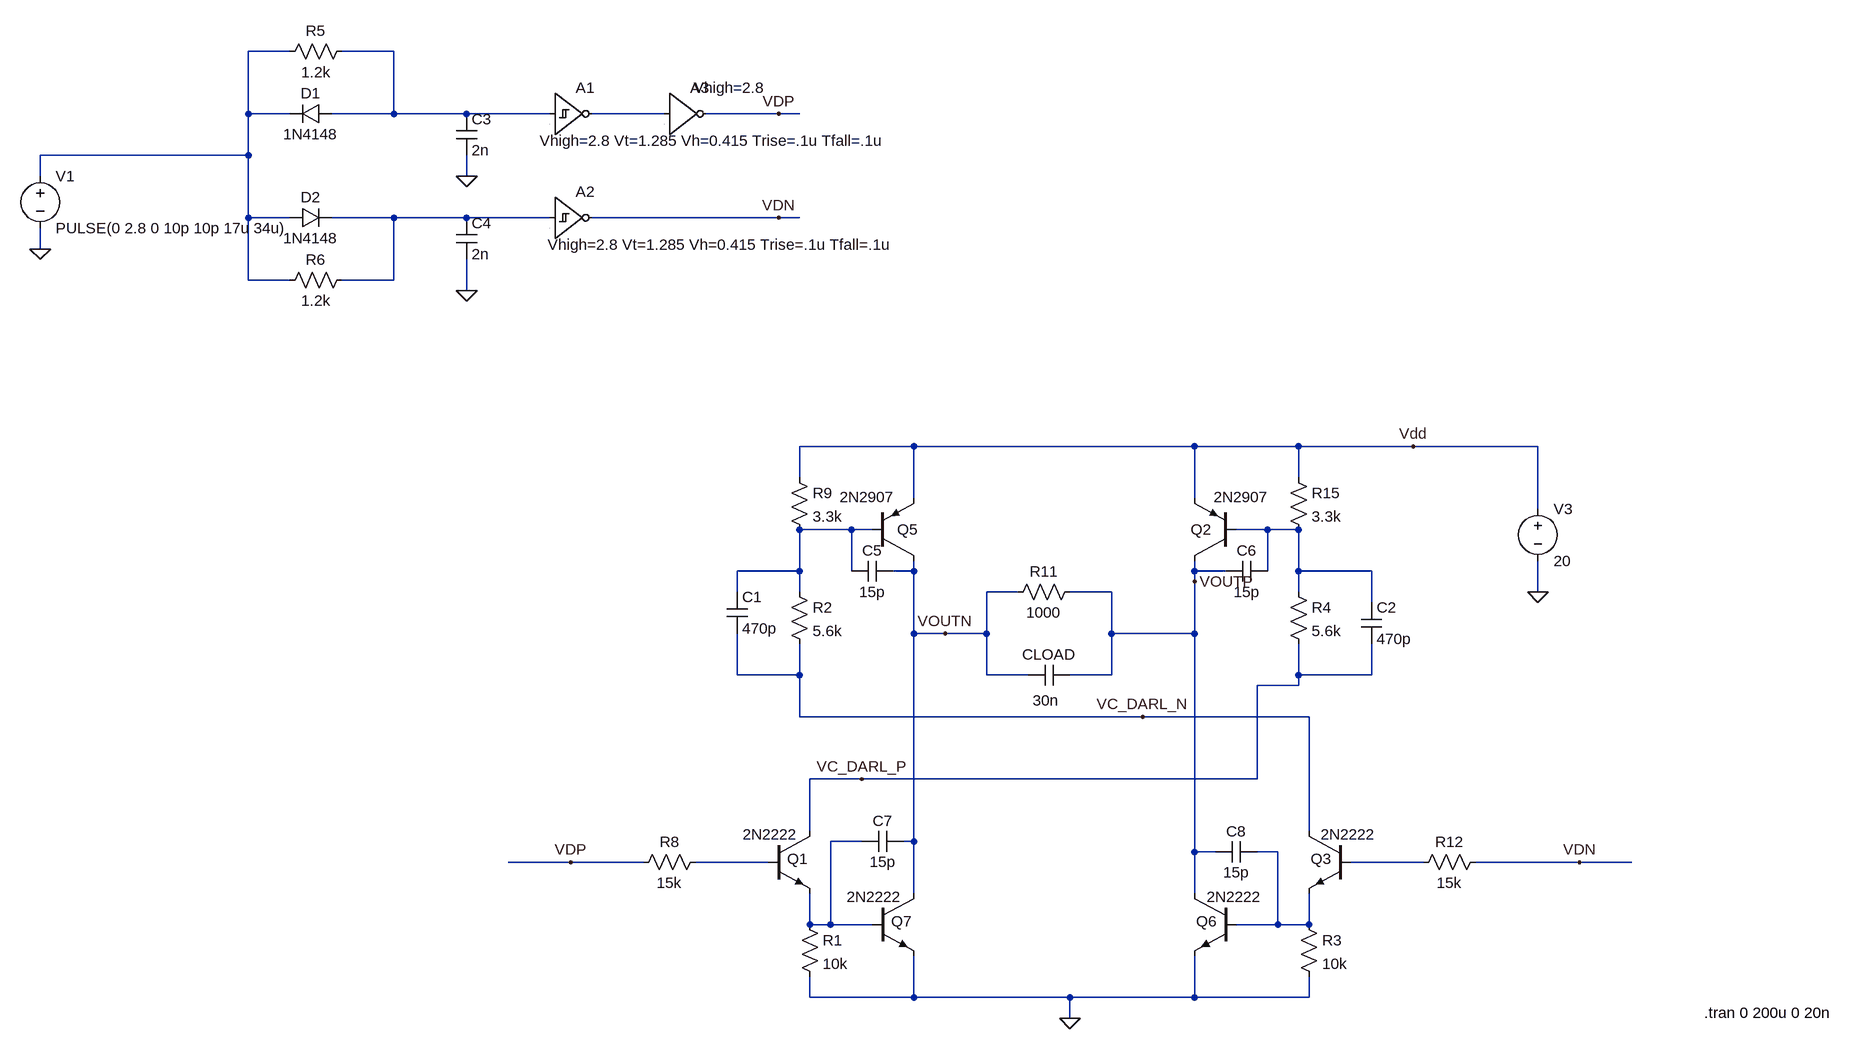
[diagram p0: schematic HbridgePiezo_opt3.asc]
HbridgePiezo_opt3.asc, the LTspice schematic file:
Version 4
SHEET 1 1368 680
WIRE -1136 -1296 -1200 -1296
WIRE -976 -1296 -1056 -1296
WIRE -1200 -1200 -1200 -1296
WIRE -1136 -1200 -1200 -1200
WIRE -976 -1200 -976 -1296
WIRE -976 -1200 -1072 -1200
WIRE -864 -1200 -976 -1200
WIRE -736 -1200 -864 -1200
WIRE -560 -1200 -672 -1200
WIRE -384 -1200 -496 -1200
WIRE -352 -1200 -384 -1200
WIRE -1200 -1136 -1200 -1200
WIRE -1200 -1136 -1520 -1136
WIRE -1520 -1104 -1520 -1136
WIRE -864 -1104 -864 -1136
WIRE -1200 -1040 -1200 -1136
WIRE -1136 -1040 -1200 -1040
WIRE -976 -1040 -1072 -1040
WIRE -864 -1040 -976 -1040
WIRE -736 -1040 -864 -1040
WIRE -384 -1040 -672 -1040
WIRE -352 -1040 -384 -1040
WIRE -1520 -992 -1520 -1024
WIRE -1200 -944 -1200 -1040
WIRE -1136 -944 -1200 -944
WIRE -976 -944 -976 -1040
WIRE -976 -944 -1056 -944
WIRE -864 -928 -864 -976
WIRE -176 -688 -352 -688
WIRE 256 -688 -176 -688
WIRE 416 -688 256 -688
WIRE 592 -688 416 -688
WIRE 784 -688 592 -688
WIRE -352 -640 -352 -688
WIRE 416 -640 416 -688
WIRE -176 -608 -176 -688
WIRE 256 -608 256 -688
WIRE 784 -592 784 -688
WIRE -272 -560 -352 -560
WIRE -240 -560 -272 -560
WIRE 368 -560 320 -560
WIRE 416 -560 368 -560
WIRE -352 -496 -352 -560
WIRE -352 -496 -448 -496
WIRE -272 -496 -272 -560
WIRE -176 -496 -176 -512
WIRE -176 -496 -208 -496
WIRE 256 -496 256 -512
WIRE 304 -496 256 -496
WIRE 368 -496 368 -560
WIRE 416 -496 416 -560
WIRE 528 -496 416 -496
WIRE 256 -480 256 -496
WIRE -448 -464 -448 -496
WIRE -352 -464 -352 -496
WIRE -16 -464 -64 -464
WIRE 128 -464 64 -464
WIRE 416 -464 416 -496
WIRE 784 -464 784 -512
WIRE 528 -448 528 -496
WIRE -176 -400 -176 -496
WIRE -128 -400 -176 -400
WIRE -64 -400 -64 -464
WIRE -64 -400 -128 -400
WIRE 128 -400 128 -464
WIRE 256 -400 256 -480
WIRE 256 -400 128 -400
WIRE -448 -336 -448 -400
WIRE -352 -336 -352 -384
WIRE -352 -336 -448 -336
WIRE -64 -336 -64 -400
WIRE 0 -336 -64 -336
WIRE 128 -336 128 -400
WIRE 128 -336 64 -336
WIRE 416 -336 416 -384
WIRE 528 -336 528 -384
WIRE 528 -336 416 -336
WIRE 416 -320 416 -336
WIRE 416 -320 352 -320
WIRE -352 -272 -352 -336
WIRE 176 -272 -352 -272
WIRE 432 -272 176 -272
WIRE -256 -176 -336 -176
WIRE 352 -176 352 -320
WIRE 352 -176 -256 -176
WIRE -336 -96 -336 -176
WIRE 432 -96 432 -272
WIRE -256 -80 -304 -80
WIRE -176 -80 -176 -400
WIRE -176 -80 -192 -80
WIRE 256 -64 256 -400
WIRE 288 -64 256 -64
WIRE 384 -64 352 -64
WIRE -704 -48 -800 -48
WIRE -592 -48 -704 -48
WIRE -400 -48 -512 -48
WIRE 608 -48 496 -48
WIRE 848 -48 688 -48
WIRE 928 -48 848 -48
WIRE -176 0 -176 -80
WIRE 256 0 256 -64
WIRE -336 48 -336 0
WIRE -304 48 -304 -80
WIRE -304 48 -336 48
WIRE -240 48 -304 48
WIRE 384 48 384 -64
WIRE 384 48 320 48
WIRE 432 48 432 0
WIRE 432 48 384 48
WIRE -336 160 -336 128
WIRE -176 160 -176 96
WIRE -176 160 -336 160
WIRE 64 160 -176 160
WIRE 256 160 256 96
WIRE 256 160 64 160
WIRE 432 160 432 128
WIRE 432 160 256 160
WIRE 64 192 64 160
FLAG 784 -464 0
FLAG 64 192 0
FLAG 592 -688 Vdd
FLAG -704 -48 VDP
FLAG 848 -48 VDN
FLAG 256 -480 VOUTP
FLAG -128 -400 VOUTN
FLAG -864 -1104 0
FLAG -864 -928 0
FLAG -1520 -992 0
FLAG -384 -1200 VDP
FLAG -384 -1040 VDN
FLAG -256 -176 VC_DARL_P
FLAG 176 -272 VC_DARL_N
SYMBOL voltage -1520 -1120 R0
WINDOW 123 0 0 Left 2
WINDOW 39 0 0 Left 2
SYMATTR InstName V1
SYMATTR Value PULSE(0 2.8 0 10p 10p 17u 34u)
SYMBOL voltage 784 -608 R0
WINDOW 123 0 0 Left 2
WINDOW 39 24 124 Left 2
SYMATTR InstName V3
SYMATTR Value 20
SYMBOL res -352 32 R0
SYMATTR InstName R1
SYMATTR Value 10k
SYMATTR SpiceLine tol=1 pwr=0.0625
SYMBOL res 416 32 R0
SYMATTR InstName R3
SYMATTR Value 10k
SYMATTR SpiceLine tol=1 pwr=0.0625
SYMBOL res 400 -480 R0
SYMATTR InstName R4
SYMATTR Value 5.6k
SYMATTR SpiceLine tol=1 pwr=0.0625
SYMBOL diode -1072 -1216 R90
WINDOW 0 0 32 VBottom 2
WINDOW 3 32 32 VTop 2
SYMATTR InstName D1
SYMATTR Value 1N4148
SYMBOL diode -1136 -1024 R270
WINDOW 0 32 32 VTop 2
WINDOW 3 0 32 VBottom 2
SYMATTR InstName D2
SYMATTR Value 1N4148
SYMBOL res -1040 -1312 R90
WINDOW 0 0 56 VBottom 2
WINDOW 3 32 56 VTop 2
SYMATTR InstName R5
SYMATTR Value 1.2k
SYMATTR SpiceLine tol=5
SYMBOL res -1040 -960 R90
WINDOW 0 0 56 VBottom 2
WINDOW 3 32 56 VTop 2
SYMATTR InstName R6
SYMATTR Value 1.2k
SYMATTR SpiceLine tol=5
SYMBOL cap -880 -1200 R0
SYMATTR InstName C3
SYMATTR Value 2n
SYMBOL cap -880 -1040 R0
SYMATTR InstName C4
SYMATTR Value 2n
SYMBOL Digital\\schmtinv -736 -1264 R0
WINDOW 3 -16 105 Left 2
SYMATTR Value Vhigh=2.8 Vt=1.285 Vh=0.415 Trise=.1u Tfall=.1u
SYMATTR InstName A1
SYMBOL Digital\\schmtinv -736 -1104 R0
WINDOW 3 -3 105 Left 2
SYMATTR Value Vhigh=2.8 Vt=1.285 Vh=0.415 Trise=.1u Tfall=.1u
SYMATTR InstName A2
SYMBOL Digital\\inv -560 -1264 R0
WINDOW 3 45 24 Left 2
SYMATTR Value Vhigh=2.8
SYMATTR InstName A3
SYMBOL cap 64 -352 R90
WINDOW 0 0 32 VBottom 2
WINDOW 3 39 37 VTop 2
SYMATTR InstName CLOAD
SYMATTR Value 30n
SYMBOL npn 496 -96 M0
WINDOW 0 29 43 Left 2
WINDOW 3 -39 5 Left 2
SYMATTR InstName Q3
SYMATTR Value 2N2222
SYMBOL res -496 -64 R90
WINDOW 0 0 56 VBottom 2
WINDOW 3 32 56 VTop 2
SYMATTR InstName R8
SYMATTR Value 15k
SYMATTR SpiceLine tol=1 pwr=0.0625
SYMBOL res 80 -480 R90
WINDOW 0 0 56 VBottom 2
WINDOW 3 32 56 VTop 2
SYMATTR InstName R11
SYMATTR Value 1000
SYMBOL npn -400 -96 R0
WINDOW 0 29 43 Left 2
WINDOW 3 -39 5 Left 2
SYMATTR InstName Q1
SYMATTR Value 2N2222
SYMBOL pnp 320 -512 R180
WINDOW 0 38 48 Left 2
WINDOW 3 -50 98 Left 2
SYMATTR InstName Q2
SYMATTR Value 2N2907
SYMBOL pnp -240 -512 M180
WINDOW 0 38 48 Left 2
WINDOW 3 -50 98 Left 2
SYMATTR InstName Q5
SYMATTR Value 2N2907
SYMBOL npn 320 0 M0
WINDOW 0 29 43 Left 2
WINDOW 3 -39 5 Left 2
SYMATTR InstName Q6
SYMATTR Value 2N2222
SYMBOL npn -240 0 R0
WINDOW 0 29 43 Left 2
WINDOW 3 -39 5 Left 2
SYMATTR InstName Q7
SYMATTR Value 2N2222
SYMBOL res 704 -64 R90
WINDOW 0 0 56 VBottom 2
WINDOW 3 32 56 VTop 2
SYMATTR InstName R12
SYMATTR Value 15k
SYMATTR SpiceLine tol=1 pwr=0.0625
SYMBOL res -368 -656 R0
SYMATTR InstName R9
SYMATTR Value 3.3k
SYMATTR SpiceLine tol=1 pwr=0.0625
SYMBOL res 400 -656 R0
SYMATTR InstName R15
SYMATTR Value 3.3k
SYMATTR SpiceLine tol=1 pwr=0.0625
SYMBOL res -368 -480 R0
SYMATTR InstName R2
SYMATTR Value 5.6k
SYMATTR SpiceLine tol=1 pwr=0.0625
SYMBOL cap -464 -464 R0
SYMATTR InstName C1
SYMATTR Value 470p
SYMBOL cap 512 -448 R0
SYMATTR InstName C2
SYMATTR Value 470p
SYMBOL cap 368 -512 R90
WINDOW 0 0 32 VBottom 2
WINDOW 3 32 32 VTop 2
SYMATTR InstName C6
SYMATTR Value 15p
SYMBOL cap -208 -512 R90
WINDOW 0 0 32 VBottom 2
WINDOW 3 32 32 VTop 2
SYMATTR InstName C5
SYMATTR Value 15p
SYMBOL cap -192 -96 R90
WINDOW 0 0 32 VBottom 2
WINDOW 3 32 32 VTop 2
SYMATTR InstName C7
SYMATTR Value 15p
SYMBOL cap 352 -80 R90
WINDOW 0 0 32 VBottom 2
WINDOW 3 32 32 VTop 2
SYMATTR InstName C8
SYMATTR Value 15p
TEXT 1040 184 Left 2 !.tran 0 200u 0 20n

The netlist it stands for:
* HbridgePiezo_opt3.asc
V1 N001 0 PULSE(0 2.8 0 10p 10p 17u 34u)
V3 Vdd 0 20
R1 N007 0 10k tol=1 pwr=0.0625
R3 N008 0 10k tol=1 pwr=0.0625
R4 N006 VC_DARL_P 5.6k tol=1 pwr=0.0625
D1 N002 N001 1N4148
D2 N001 N004 1N4148
R5 N002 N001 1.2k tol=5
R6 N004 N001 1.2k tol=5
C3 N002 0 2n
C4 N004 0 2n
A1 N002 0 0 0 0 N003 0 0 SCHMITT Vhigh=2.8 Vt=1.285 Vh=0.415 Trise=.1u Tfall=.1u
A2 N004 0 0 0 0 VDN 0 0 SCHMITT Vhigh=2.8 Vt=1.285 Vh=0.415 Trise=.1u Tfall=.1u
A3 N003 0 0 0 0 VDP 0 0 BUF Vhigh=2.8
CLOAD VOUTP VOUTN 30n
Q3 VC_DARL_N N010 N008 0 2N2222
R8 N009 VDP 15k tol=1 pwr=0.0625
R11 VOUTP VOUTN 1000
Q1 VC_DARL_P N009 N007 0 2N2222
Q2 VOUTP N006 Vdd 0 2N2907
Q5 VOUTN N005 Vdd 0 2N2907
Q6 VOUTP N008 0 0 2N2222
Q7 VOUTN N007 0 0 2N2222
R12 VDN N010 15k tol=1 pwr=0.0625
R9 Vdd N005 3.3k tol=1 pwr=0.0625
R15 Vdd N006 3.3k tol=1 pwr=0.0625
R2 N005 VC_DARL_N 5.6k tol=1 pwr=0.0625
C1 N005 VC_DARL_N 470p
C2 N006 VC_DARL_P 470p
C6 N006 VOUTP 15p
C5 VOUTN N005 15p
C7 VOUTN N007 15p
C8 N008 VOUTP 15p
.model D D
.lib standard.dio
.model NPN NPN
.model PNP PNP
.lib standard.bjt
.tran 0 200u 0 20n
.backanno
.end